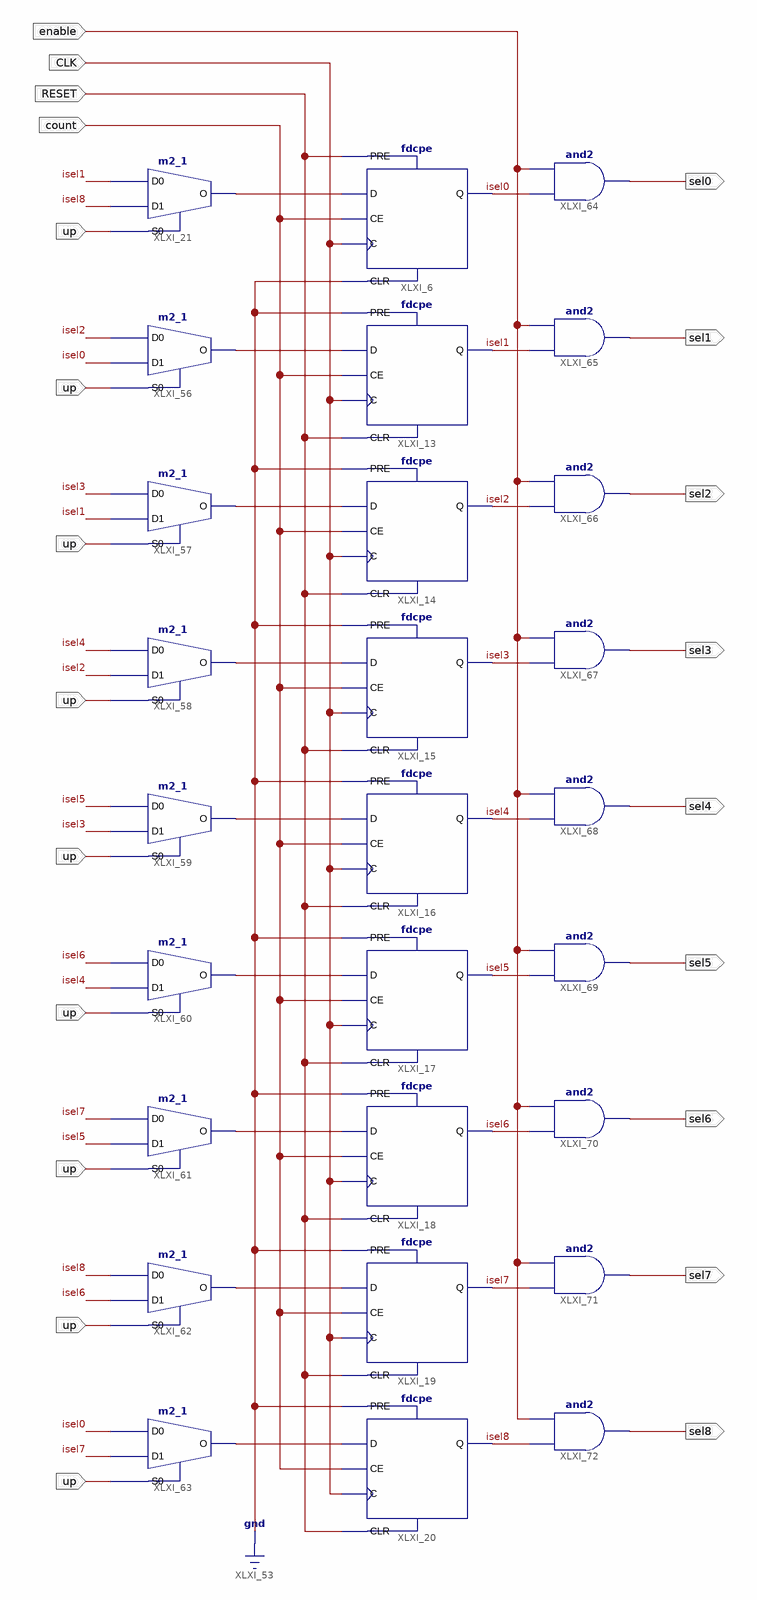
[diagram p0: schematic sheet 1]
// Xilinx ISE schematic shift9.sch (spartan3e) as structural Verilog: 27 symbols, 14 ports
module shift9 (
  input  RESET,
  input  CLK,
  input  count,
  input  up,
  input  enable,
  output sel0,
  output sel1,
  output sel2,
  output sel3,
  output sel4,
  output sel5,
  output sel6,
  output sel7,
  output sel8
);

  wire isel0, isel1, isel2, isel3, isel4, isel5, isel6, isel7, isel8, XLXN_76, XLXN_77, XLXN_78, XLXN_79,
       XLXN_80, XLXN_81, XLXN_82, XLXN_83, XLXN_84;

  fdcpe XLXI_6 (.C(CLK), .CE(count), .CLR(1'b0), .D(XLXN_76), .PRE(RESET), .Q(isel0));
  fdcpe XLXI_13 (.C(CLK), .CE(count), .CLR(RESET), .D(XLXN_77), .PRE(1'b0), .Q(isel1));
  fdcpe XLXI_14 (.C(CLK), .CE(count), .CLR(RESET), .D(XLXN_78), .PRE(1'b0), .Q(isel2));
  fdcpe XLXI_15 (.C(CLK), .CE(count), .CLR(RESET), .D(XLXN_79), .PRE(1'b0), .Q(isel3));
  fdcpe XLXI_16 (.C(CLK), .CE(count), .CLR(RESET), .D(XLXN_80), .PRE(1'b0), .Q(isel4));
  fdcpe XLXI_17 (.C(CLK), .CE(count), .CLR(RESET), .D(XLXN_81), .PRE(1'b0), .Q(isel5));
  fdcpe XLXI_18 (.C(CLK), .CE(count), .CLR(RESET), .D(XLXN_82), .PRE(1'b0), .Q(isel6));
  fdcpe XLXI_19 (.C(CLK), .CE(count), .CLR(RESET), .D(XLXN_83), .PRE(1'b0), .Q(isel7));
  fdcpe XLXI_20 (.C(CLK), .CE(count), .CLR(RESET), .D(XLXN_84), .PRE(1'b0), .Q(isel8));
  m2_1 XLXI_56 (.D0(isel2), .D1(isel0), .S0(up), .O(XLXN_77));
  m2_1 XLXI_57 (.D0(isel3), .D1(isel1), .S0(up), .O(XLXN_78));
  m2_1 XLXI_60 (.D0(isel6), .D1(isel4), .S0(up), .O(XLXN_81));
  m2_1 XLXI_62 (.D0(isel8), .D1(isel6), .S0(up), .O(XLXN_83));
  m2_1 XLXI_63 (.D0(isel0), .D1(isel7), .S0(up), .O(XLXN_84));
  m2_1 XLXI_61 (.D0(isel7), .D1(isel5), .S0(up), .O(XLXN_82));
  m2_1 XLXI_59 (.D0(isel5), .D1(isel3), .S0(up), .O(XLXN_80));
  m2_1 XLXI_58 (.D0(isel4), .D1(isel2), .S0(up), .O(XLXN_79));
  m2_1 XLXI_21 (.D0(isel1), .D1(isel8), .S0(up), .O(XLXN_76));
  and XLXI_64 (sel0, isel0, enable);
  and XLXI_65 (sel1, isel1, enable);
  and XLXI_66 (sel2, isel2, enable);
  and XLXI_67 (sel3, isel3, enable);
  and XLXI_68 (sel4, isel4, enable);
  and XLXI_69 (sel5, isel5, enable);
  and XLXI_70 (sel6, isel6, enable);
  and XLXI_71 (sel7, isel7, enable);
  and XLXI_72 (sel8, isel8, enable);
endmodule
